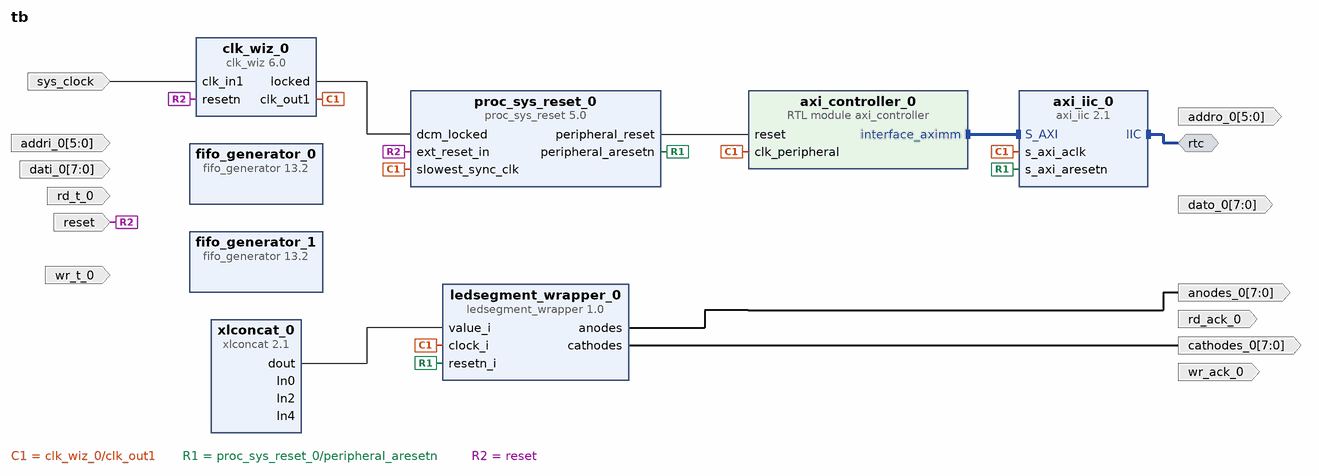
[diagram p0: block diagram of the top level]
# Vivado block design tb, xc7a100tcsg324-1, Vivado 2021.2
create_bd_design tb

create_bd_intf_port -mode Master -vlnv xilinx.com:interface:iic_rtl:1.0 rtc
create_bd_port -dir I -type clk sys_clock
set_property -dict {CONFIG.FREQ_HZ 100000000 CONFIG.PHASE 0.0} [get_bd_ports sys_clock]
create_bd_port -dir I -type rst reset
set_property -dict {CONFIG.POLARITY ACTIVE_LOW} [get_bd_ports reset]
create_bd_port -dir I -from 5 -to 0 addri_0
create_bd_port -dir O -from 5 -to 0 addro_0
create_bd_port -dir I -from 7 -to 0 dati_0
create_bd_port -dir O -from 7 -to 0 dato_0
create_bd_port -dir O rd_ack_0
create_bd_port -dir I rd_t_0
create_bd_port -dir O wr_ack_0
create_bd_port -dir I wr_t_0
create_bd_port -dir O -from 7 -to 0 anodes_0
create_bd_port -dir O -from 7 -to 0 cathodes_0

create_bd_cell -type ip -vlnv xilinx.com:ip:clk_wiz:6.0 clk_wiz_0
set_property -dict [list \
  CONFIG.CLKOUT1_JITTER 300.893 \
  CONFIG.CLKOUT1_PHASE_ERROR 293.793 \
  CONFIG.CLKOUT1_REQUESTED_OUT_FREQ 28 \
  CONFIG.CLK_IN1_BOARD_INTERFACE sys_clock \
  CONFIG.MMCM_CLKFBOUT_MULT_F 49.875 \
  CONFIG.MMCM_CLKOUT0_DIVIDE_F 35.625 \
  CONFIG.MMCM_DIVCLK_DIVIDE 5 \
  CONFIG.RESET_BOARD_INTERFACE reset \
  CONFIG.RESET_PORT resetn \
  CONFIG.RESET_TYPE ACTIVE_LOW \
  CONFIG.USE_BOARD_FLOW true \
  CONFIG.USE_LOCKED true \
] [get_bd_cells clk_wiz_0]
create_bd_cell -type ip -vlnv xilinx.com:ip:proc_sys_reset:5.0 proc_sys_reset_0
create_bd_cell -type ip -vlnv xilinx.com:ip:xlconcat:2.1 xlconcat_0
set_property -dict {CONFIG.IN1_WIDTH 2 CONFIG.IN3_WIDTH 1 CONFIG.IN5_WIDTH 9 CONFIG.NUM_PORTS 7} [get_bd_cells xlconcat_0]
create_bd_cell -type ip -vlnv xilinx.com:user:ledsegment_wrapper:1.0 ledsegment_wrapper_0
create_bd_cell -type ip -vlnv xilinx.com:ip:axi_iic:2.1 axi_iic_0
create_bd_cell -type ip -vlnv xilinx.com:ip:fifo_generator:13.2 fifo_generator_0
set_property -dict {CONFIG.Input_Data_Width 17 CONFIG.Output_Data_Width 17} [get_bd_cells fifo_generator_0]
create_bd_cell -type ip -vlnv xilinx.com:ip:fifo_generator:13.2 fifo_generator_1
set_property -dict [list \
  CONFIG.Input_Data_Width 16 \
  CONFIG.Output_Data_Width 16 \
  CONFIG.Valid_Flag true \
  CONFIG.Write_Acknowledge_Flag true \
] [get_bd_cells fifo_generator_1]
create_bd_cell -type module -reference axi_controller axi_controller_0

# ---- connections ----

connect_bd_intf_net [get_bd_intf_pins axi_controller_0/interface_aximm] [get_bd_intf_pins axi_iic_0/S_AXI]
connect_bd_intf_net [get_bd_intf_ports rtc] [get_bd_intf_pins axi_iic_0/IIC]
# net addri_0_1 has one end: addri_0
# net axi_controller_0_addro has one end: addro_0
# net axi_controller_0_dato has one end: dato_0
# net axi_controller_0_rd_ack has one end: rd_ack_0
# net axi_controller_0_rstate has one end: xlconcat_0/In2
# net axi_controller_0_state has one end: xlconcat_0/In0
# net axi_controller_0_wr_ack has one end: wr_ack_0
# net axi_controller_0_wstate has one end: xlconcat_0/In4
connect_bd_net [get_bd_pins clk_wiz_0/clk_out1] \
  [get_bd_pins proc_sys_reset_0/slowest_sync_clk] [get_bd_pins ledsegment_wrapper_0/clock_i] \
  [get_bd_pins axi_iic_0/s_axi_aclk] [get_bd_pins axi_controller_0/clk_peripheral]
connect_bd_net [get_bd_pins clk_wiz_0/locked] [get_bd_pins proc_sys_reset_0/dcm_locked]
# net dati_0_1 has one end: dati_0
connect_bd_net [get_bd_pins ledsegment_wrapper_0/anodes] [get_bd_ports anodes_0]
connect_bd_net [get_bd_pins ledsegment_wrapper_0/cathodes] [get_bd_ports cathodes_0]
connect_bd_net [get_bd_pins proc_sys_reset_0/peripheral_aresetn] [get_bd_pins ledsegment_wrapper_0/resetn_i] [get_bd_pins axi_iic_0/s_axi_aresetn]
connect_bd_net [get_bd_pins proc_sys_reset_0/peripheral_reset] [get_bd_pins axi_controller_0/reset]
# net rd_t_0_1 has one end: rd_t_0
connect_bd_net [get_bd_ports reset] [get_bd_pins clk_wiz_0/resetn] [get_bd_pins proc_sys_reset_0/ext_reset_in]
connect_bd_net [get_bd_ports sys_clock] [get_bd_pins clk_wiz_0/clk_in1]
# net wr_t_0_1 has one end: wr_t_0
connect_bd_net [get_bd_pins xlconcat_0/dout] [get_bd_pins ledsegment_wrapper_0/value_i]

# ---- address map ----
assign_bd_address -offset 0x0000 -range 512 -target_address_space [get_bd_addr_spaces axi_controller_0/interface_aximm] [get_bd_addr_segs axi_iic_0/S_AXI/Reg]

validate_bd_design
save_bd_design
